# Altium schematic sheet Debug Interface.SchDoc
size A4; Organization: TESLA Motors, INC; Address1: 3500 Deer Creek Road; Address2: Palo Alto, CA; Address4: U.S.A.; SheetNumber: 13; SheetTotal: 13
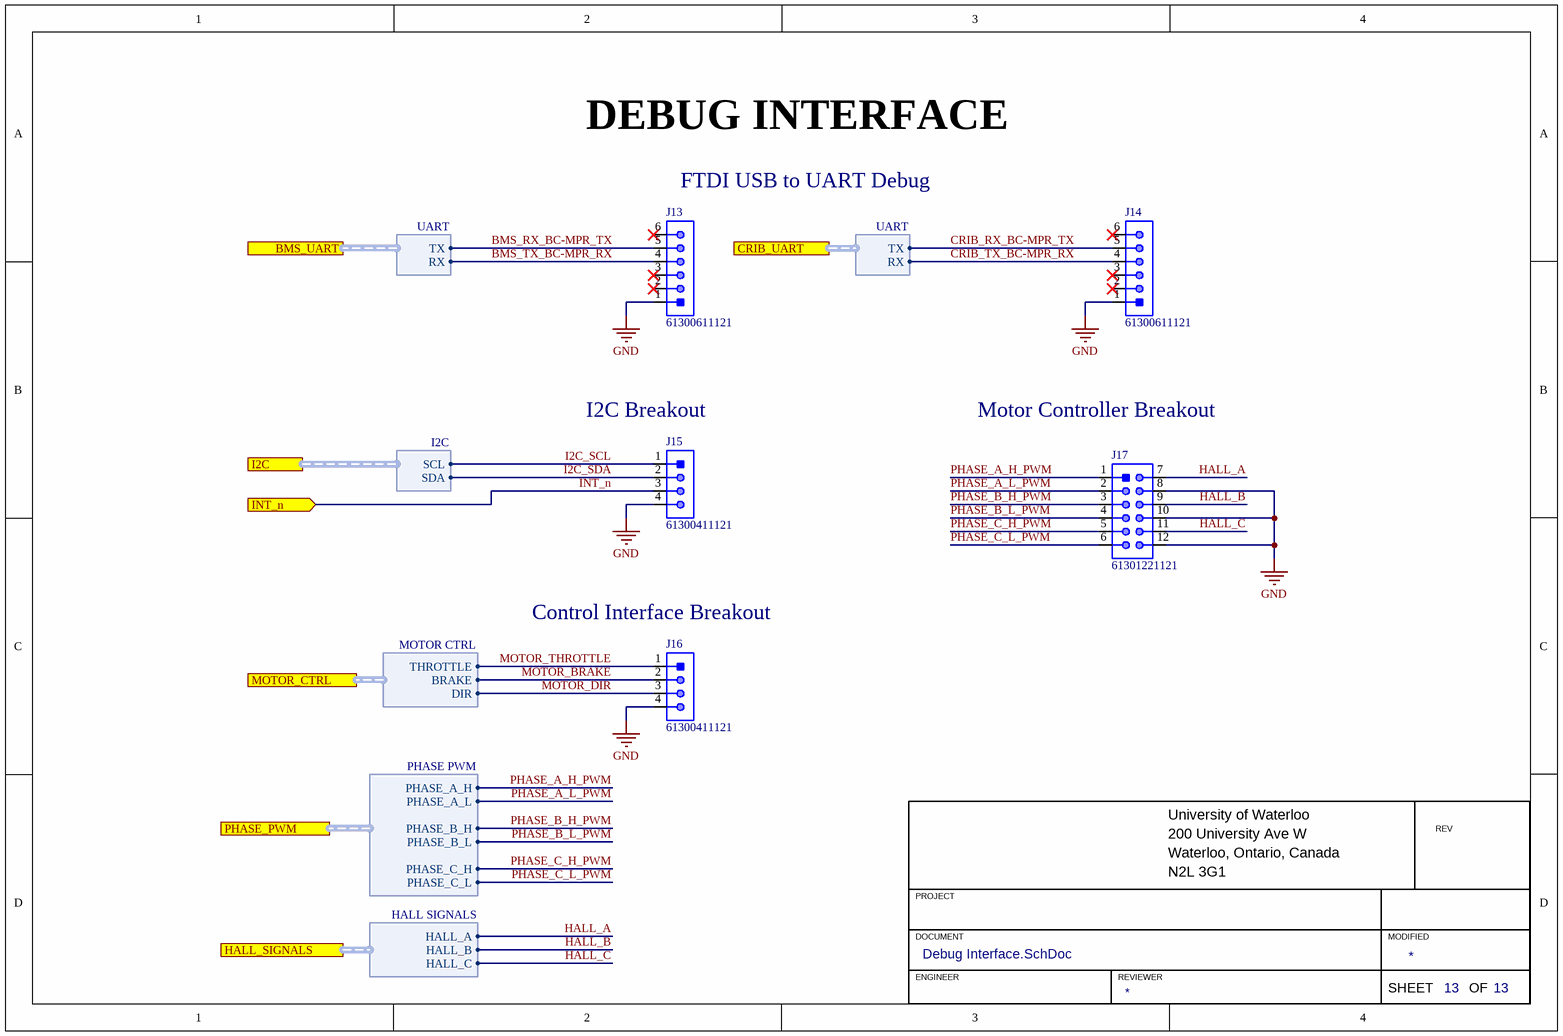
[diagram p0: Debug Interface.SchDoc]

## Parts
J13  Manufacturer Part Number 1: 61300611121  [HDR1X6]  (hidden comment: HEADER 6x1)
J14  Manufacturer Part Number 1: 61300611121  [HDR1X6]  (hidden comment: HEADER 6x1)
J15  Manufacturer Part Number 1: 61300411121  [HDR1X4]  (hidden comment: HEADER 4x1)
J16  Manufacturer Part Number 1: 61300411121  [HDR1X4]  (hidden comment: HEADER 4x1)
J17  Manufacturer Part Number 1: 61301221121  [HDR2X6]  (hidden comment: HEADER 6x2)

## Ports
BMS_UART (harness UART), CRIB_UART (harness UART), HALL_SIGNALS (harness HALL SIGNALS), I2C (harness I2C), INT_n (in), MOTOR_CTRL (harness MOTOR CTRL), PHASE_PWM (harness PHASE PWM)

## Harnesses
UART: TX, RX
I2C: SCL, SDA
MOTOR CTRL: THROTTLE, BRAKE, DIR
PHASE PWM: PHASE_A_H, PHASE_A_L, PHASE_B_H, PHASE_B_L, PHASE_C_H, PHASE_C_L
HALL SIGNALS: HALL_A, HALL_B, HALL_C

## Nets
GND: J13.1 J14.1 J15.4 J16.4 J17.8 J17.10 J17.12
BMS_RX_BC-MPR_TX: J13.5 ; port BMS_UART.TX
BMS_TX_BC-MPR_RX: J13.4 ; port BMS_UART.RX
CRIB_RX_BC-MPR_TX: J14.5 ; port CRIB_UART.TX
CRIB_TX_BC-MPR_RX: J14.4 ; port CRIB_UART.RX
HALL_A: J17.7 ; port HALL_SIGNALS.HALL_A
HALL_B: J17.9 ; port HALL_SIGNALS.HALL_B
HALL_C: J17.11 ; port HALL_SIGNALS.HALL_C
I2C_SCL: J15.1 ; port I2C.SCL
I2C_SDA: J15.2 ; port I2C.SDA
INT_n: J15.3 ; port INT_n
MOTOR_BRAKE: J16.2 ; port MOTOR_CTRL.BRAKE
MOTOR_DIR: J16.3 ; port MOTOR_CTRL.DIR
MOTOR_THROTTLE: J16.1 ; port MOTOR_CTRL.THROTTLE
PHASE_A_H_PWM: J17.1 ; port PHASE_PWM.PHASE_A_H
PHASE_A_L_PWM: J17.2 ; port PHASE_PWM.PHASE_A_L
PHASE_B_H_PWM: J17.3 ; port PHASE_PWM.PHASE_B_H
PHASE_B_L_PWM: J17.4 ; port PHASE_PWM.PHASE_B_L
PHASE_C_H_PWM: J17.5 ; port PHASE_PWM.PHASE_C_H
PHASE_C_L_PWM: J17.6 ; port PHASE_PWM.PHASE_C_L

Not connected (* = marked no-connect by the designer): J13 2* 3* 6*; J14 2* 3* 6*

## Notes on the sheet
- DEBUG INTERFACE
- (near J13) FTDI USB to UART Debug
- (near J15) I2C Breakout
- Motor Controller Breakout
- (near J16) Control Interface Breakout
- University of Waterloo
- 200 University Ave W
- REV
- PROJECT
- Waterloo, Ontario, Canada
- N2L 3G1
- DOCUMENT
- ENGINEER
- REVIEWER
- MODIFIED
- SHEET
- OF

## Library data of the parts
J13 J14 = HEADER 6x1: CONN HEADER VERT 6POS 2.54MM; Manufacturer 1: Würth Elektronik; Supplier 1: Digi-Key; Mounting Type: TH; Pitch: 2.54mm; Supplier Part Number 1: 732-5319-ND
J15 J16 = HEADER 4x1: CONN HEADER VERT 4POS 2.54MM; Manufacturer 1: Würth Elektronik; Mounting Type: TH; Pitch: 2.54mm; Supplier 1: Digikey; Supplier Part Number 1: 732-5317-ND
J17 = HEADER 6x2: CONN HEADER VERT 12POS 2.54MM; Manufacturer 1: Würth Elektronik; Supplier 1: Digi-Key; Mounting Type: TH; Pitch: 2.54mm; Supplier Part Number 1: 732-5297-ND